# Altium schematic sheet MSP430G2553.SchDoc: MSP430G2552 connections
size A4; DrawnBy: Mandus Börjesson; Revision: A
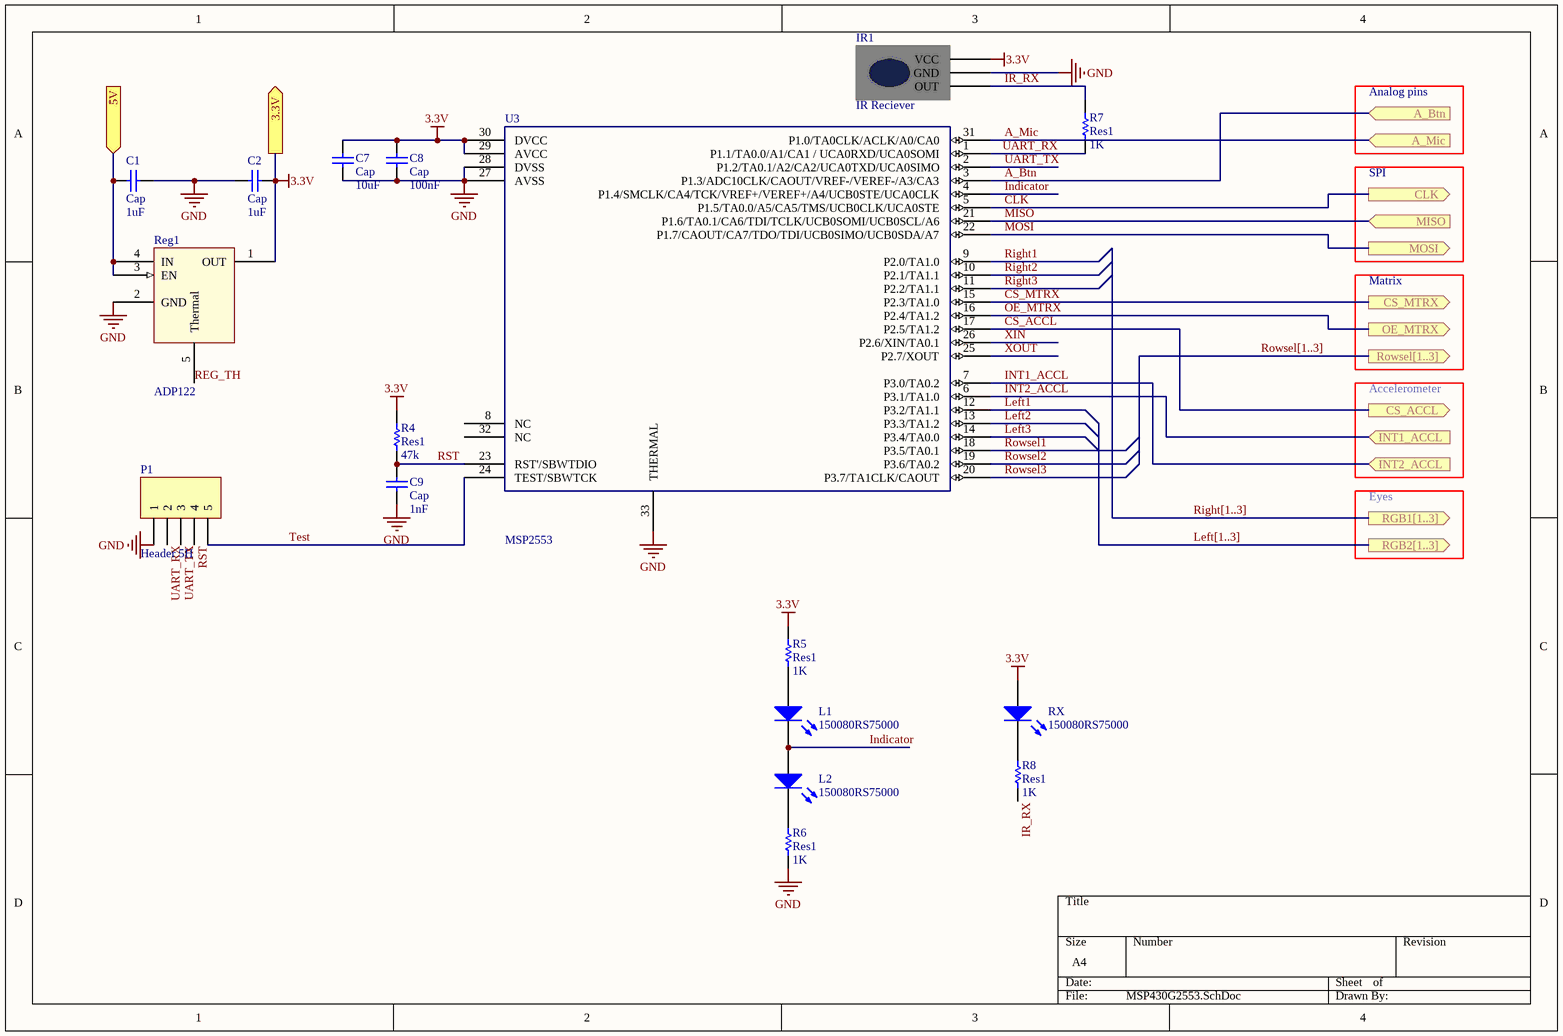
[diagram p0: MSP430G2553.SchDoc]

## Parts
C1  Cap  value 1uF  [6-0805_M]
C2  Cap  value 1uF  [6-0805_M]
C7  Cap  value 10uF  [6-0805_N]
C8  Cap  value 100nF  [6-0805_N]
C9  Cap  value 1nF  [6-0805_N]
IR1  IR Reciever  [IR]
L1  150080RS75000  [0805_A]
L2  150080RS75000  [0805_A]
P1  Header 5H  [HDR1X5H]
R4  Res1  value 47k  [6-0805_N]
R5  Res1  value 1K  [6-0805_M]
R6  Res1  value 1K  [6-0805_M]
R7  Res1  value 1K  [6-0805_M]
R8  Res1  value 1K  [6-0805_N]
Reg1  ADP122  [SOP5]
RX  150080RS75000  [0805_A]
U3  MSP2553  [QFN32]

## Ports
3.3V (out), 5V (in), A_Btn (in), A_Mic (in), CLK (out), CS_ACCL (out), CS_MTRX (out), INT1_ACCL (in), INT2_ACCL (in), MISO (in), MOSI (out), OE_MTRX (out), RGB1[1..3] (out), RGB2[1..3] (out), Rowsel[1..3] (out)

## Nets
3.3V: C2.1 C7.1 C8.1 IR1.2(VCC) R4.2 R5.2 Reg1.1(OUT) RX.2(A) U3.29(AVCC) U3.30(DVCC) ; port 3.3V
GND: C1.1 C2.2 C7.2 C8.2 C9.1 IR1.1(GND) P1.1 R6.1 Reg1.2(GND) U3.27(AVSS) U3.28(DVSS) U3.33(THERMAL)
5V: C1.2 Reg1.3(EN) Reg1.4(IN) ; port 5V
A_Btn: U3.3(P1.3/ADC10CLK/CAOUT/VREF-/VEREF-/A3/CA3) ; port A_Btn
A_Mic: U3.31(P1.0/TA0CLK/ACLK/A0/CA0) ; port A_Mic
CLK: U3.5(P1.5/TA0.0/A5/CA5/TMS/UCB0CLK/UCA0STE) ; port CLK
CS_ACCL: U3.17(P2.5/TA1.2) ; port CS_ACCL
CS_MTRX: U3.15(P2.3/TA1.0) ; port CS_MTRX
Indicator: L1.1(K) L2.2(A) U3.4(P1.4/SMCLK/CA4/TCK/VREF+/VEREF+/A4/UCB0STE/UCA0CLK)
INT1_ACCL: U3.7(P3.0/TA0.2) ; port INT2_ACCL
INT2_ACCL: U3.6(P3.1/TA1.0) ; port INT1_ACCL
IR_RX: IR1.0(OUT) R7.1 R8.1
Left1: U3.12(P3.2/TA1.1)
Left2: U3.13(P3.3/TA1.2)
Left3: U3.14(P3.4/TA0.0)
MISO: U3.21(P1.6/TA0.1/CA6/TDI/TCLK/UCB0SOMI/UCB0SCL/A6) ; port MISO
MOSI: U3.22(P1.7/CAOUT/CA7/TDO/TDI/UCB0SIMO/UCB0SDA/A7) ; port MOSI
OE_MTRX: U3.16(P2.4/TA1.2) ; port OE_MTRX
REG_TH: Reg1.5(Thermal)
Right1: U3.9(P2.0/TA1.0)
Right2: U3.10(P2.1/TA1.1)
Right3: U3.11(P2.2/TA1.1)
Rowsel1: U3.18(P3.5/TA0.1)
Rowsel2: U3.19(P3.6/TA0.2)
Rowsel3: U3.20(P3.7/TA1CLK/CAOUT)
RST: C9.2 P1.4 R4.1 U3.23(RST'/SBWTDIO)
Test: P1.5 U3.24(TEST/SBWTCK)
UART_RX: P1.2 R7.2 U3.1(P1.1/TA0.0/A1/CA1_/_UCA0RXD/UCA0SOMI)
UART_TX: P1.3 U3.2(P1.2/TA0.1/A2/CA2/UCA0TXD/UCA0SIMO)
XIN: U3.26(P2.6/XIN/TA0.1)
XOUT: U3.25(P2.7/XOUT)
NetL1_2: L1.2(A) R5.1
NetL2_1: L2.1(K) R6.2
NetR8_2: R8.2 RX.1(K)

Not connected (* = marked no-connect by the designer): U3 8(NC) 32(NC)

## Buses and harness runs
bus Left[1..3] = port RGB2[1..3]
bus Right[1..3] = port RGB1[1..3]
bus Rowsel[1..3] = port Rowsel[1..3]

## Notes on the sheet
- Analog pins
- SPI
- Matrix
- Accelerometer
- Eyes

## Library data of the parts
C1 C2 C7-C9 = Cap: Capacitor; Published: 8-Jun-2000; LatestRevisionDate: 17-Jul-2002; LatestRevisionNote: Re-released for DXP Platform.; PackageReference: RAD-0.3; Publisher: Altium Limited; PackageDescription: Radial Cap, Thru-Hole; 2 Leads; 0.3 in Pin Spacing
IR1 = Component_1: 38kHz Infrared reciever module
L1 L2 RX = 150080RS75000: SMD mono-color Chip LED, WL-SMCW, Red; PackageReference: 0805_A; Color: Red; PartNumber: 150080RS75000; ComponentLink1Description: Manufacturer URL; ComponentLink1URL: http://www.we-online.com; ComponentLink2Description: Datasheet; ComponentLink2URL: http://katalog.we-online.com/led/datasheet/150080RS75000.pdf
P1 = Header 5H: Header, 5-Pin, Right Angle; LatestRevisionDate: 17-Jul-2002; LatestRevisionNote: Re-released for DXP Platform.; Publisher: Altium Limited
R4-R8 = Res1: Resistor; Published: 8-Jun-2000; LatestRevisionDate: 17-Jul-2002; LatestRevisionNote: Re-released for DXP Platform.; PackageReference: AXIAL-0.3; Publisher: Altium Limited; PackageDescription: Axial Device, Thru-Hole; 2 Leads; 0.3 in Pin Spacing
Reg1 = REG: LD59030DTPU33R 3.3V regulator; pin to pad: 1>5 4>1 5>4
U3 = MSP430G2553: MSP4302553 Microcontroller, QFN package